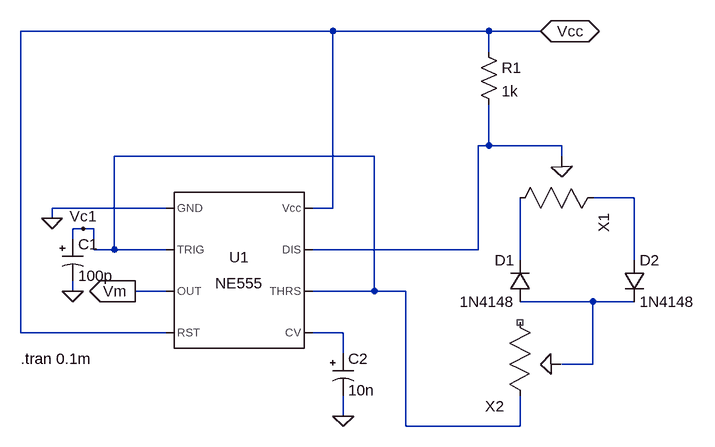
[diagram p0: schematic oscilador_exp.asc]
oscilador_exp.asc, the LTspice schematic file:
Version 4
SHEET 1 1868 680
WIRE 368 -176 -112 -176
WIRE 608 -176 368 -176
WIRE 688 -176 608 -176
WIRE 608 -144 608 -176
WIRE 608 0 608 -64
WIRE 608 0 592 0
WIRE 720 0 608 0
WIRE 432 16 32 16
WIRE 720 16 720 0
WIRE 832 80 768 80
WIRE 112 96 -64 96
WIRE 368 96 368 -176
WIRE 368 96 336 96
WIRE -64 112 -64 96
WIRE -16 128 -32 128
WIRE 0 128 -16 128
WIRE -32 144 -32 128
WIRE 0 160 0 128
WIRE 32 160 32 16
WIRE 32 160 0 160
WIRE 112 160 32 160
WIRE 592 160 592 0
WIRE 592 160 336 160
WIRE 656 176 656 80
WIRE 832 176 832 80
WIRE -32 224 -32 208
WIRE 112 224 64 224
WIRE 432 224 432 16
WIRE 432 224 336 224
WIRE 480 224 432 224
WIRE 768 240 656 240
WIRE 832 240 768 240
WIRE -112 288 -112 -176
WIRE 112 288 -112 288
WIRE 384 288 336 288
WIRE 384 320 384 288
WIRE 768 336 768 240
WIRE 768 336 720 336
WIRE 384 416 384 384
WIRE 480 432 480 224
WIRE 656 432 656 384
WIRE 656 432 480 432
FLAG -64 112 0
FLAG 384 416 0
FLAG -32 224 0
FLAG 64 224 Vm
IOPIN 64 224 Out
FLAG -16 128 Vc1
FLAG 688 -176 Vcc
IOPIN 688 -176 BiDir
SYMBOL Misc\\NE555 224 192 R0
SYMATTR InstName U1
SYMBOL res 592 -160 R0
SYMATTR InstName R1
SYMATTR Value 1k
SYMBOL diode 672 240 R180
WINDOW 0 24 64 Left 2
WINDOW 3 24 0 Left 2
SYMATTR InstName D1
SYMATTR Value 1N4148
SYMBOL diode 816 176 R0
SYMATTR InstName D2
SYMATTR Value 1N4148
SYMBOL mypot 752 64 R90
SYMATTR InstName X1
SYMATTR SpiceLine R=50k Val=50
SYMBOL mypot 672 368 R180
SYMATTR InstName X2
SYMBOL polcap -48 144 R0
SYMATTR InstName C1
SYMATTR Value 100p
SYMBOL polcap 368 320 R0
SYMATTR InstName C2
SYMATTR Value 10n
TEXT -112 328 Left 2 !.tran 0.1m

The netlist it stands for:
* oscilador_exp.asc
XU1 0 Vc1 Vm Vcc N005 Vc1 N001 Vcc NE555  ; pins GND TRIG OUT RST CV THRS DIS Vcc
R1 Vcc N001 1k
D1 N004 N003 1N4148
D2 N002 N004 1N4148
XX1 N002 N001 N003 mypot R=50k Val=50  ; pins 1 2 3
XX2 Vc1 N004 NC_01 mypot R=10k Val=50  ; pins 1 2 3
C1 Vc1 0 100p
C2 N005 0 10n
.model D D
.lib standard.dio
.tran 0.1m
.lib NE555.sub
.backanno
.end